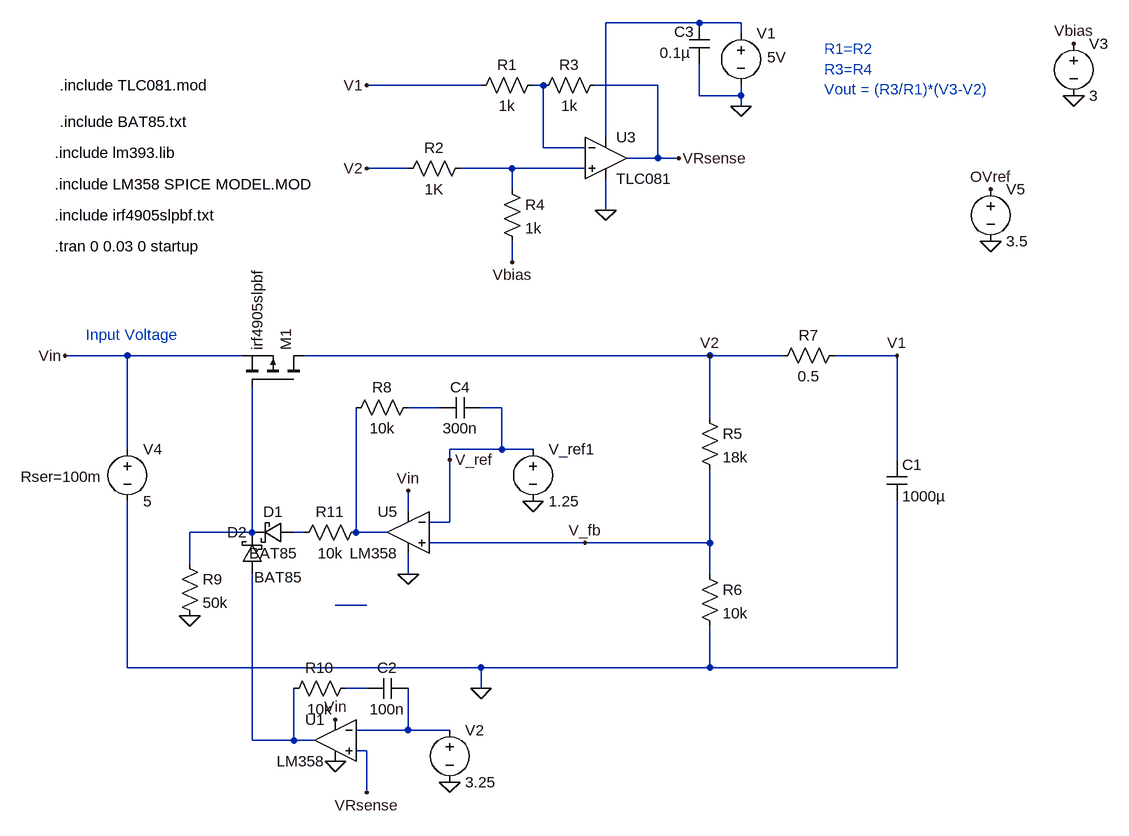
[diagram p0: schematic Differential_Amplifier.asc]
Differential_Amplifier.asc, the LTspice schematic file:
Version 4
SHEET 1 1252 1408
WIRE 320 48 176 48
WIRE 384 48 320 48
WIRE 384 64 384 48
WIRE -16 144 -192 144
WIRE 80 144 64 144
WIRE 256 144 160 144
WIRE 320 160 320 112
WIRE 384 160 384 144
WIRE 384 160 320 160
WIRE 384 176 384 160
WIRE 176 224 176 48
WIRE 80 240 80 144
WIRE 144 240 80 240
WIRE 256 256 256 144
WIRE 256 256 208 256
WIRE 288 256 256 256
WIRE -128 272 -192 272
WIRE 32 272 -48 272
WIRE 144 272 32 272
WIRE 32 304 32 272
WIRE 176 336 176 288
WIRE 32 416 32 384
WIRE -560 560 -656 560
WIRE -384 560 -560 560
WIRE 336 560 -288 560
WIRE 448 560 336 560
WIRE 624 560 528 560
WIRE -80 640 -128 640
WIRE 16 640 -16 640
WIRE 336 656 336 560
WIRE -560 704 -560 560
WIRE 16 704 16 640
WIRE 16 704 -64 704
WIRE 64 704 16 704
WIRE -368 832 -368 608
WIRE -64 720 -64 704
WIRE 624 720 624 560
WIRE -128 800 -128 768
WIRE -64 816 -64 720
WIRE -64 816 -96 816
WIRE -368 832 -464 832
WIRE -288 832 -304 832
WIRE -208 832 -208 640
WIRE -160 832 -208 832
WIRE 144 848 -96 848
WIRE 336 848 336 736
WIRE 336 848 144 848
WIRE -464 880 -464 832
WIRE -128 896 -128 864
WIRE 336 896 336 848
WIRE -192 944 -240 944
WIRE -560 1040 -560 784
WIRE -16 1040 -560 1040
WIRE 336 1040 336 976
WIRE 336 1040 -16 1040
WIRE 624 1040 624 784
WIRE 624 1040 336 1040
WIRE -192 1072 -224 1072
WIRE -16 1072 -16 1040
WIRE -128 1136 -128 1072
WIRE -128 1136 -208 1136
WIRE -64 1136 -128 1136
WIRE -368 1152 -368 896
WIRE -304 1152 -304 1072
WIRE -304 1152 -368 1152
WIRE -272 1152 -304 1152
WIRE -192 1168 -208 1168
WIRE -192 1232 -192 1168
FLAG 384 176 0
FLAG 176 336 0
FLAG 64 784 0
FLAG -128 896 0
FLAG -16 1072 0
FLAG -656 560 Vin
FLAG -128 768 Vin
FLAG 144 848 V_fb
FLAG -64 720 V_ref
FLAG -192 272 V2
FLAG -192 144 V1
FLAG 288 256 VRsense
FLAG -464 960 0
FLAG -240 1120 Vin
FLAG -240 1184 0
FLAG -64 1216 0
FLAG -192 1232 VRsense
FLAG 336 560 V2
FLAG 624 560 V1
FLAG 896 160 0
FLAG 896 80 Vbias
FLAG 768 304 OVref
FLAG 768 384 0
FLAG 32 416 Vbias
SYMBOL voltage 384 48 R0
WINDOW 3 40 53 Left 2
WINDOW 123 0 0 Left 2
WINDOW 39 0 0 Left 2
SYMATTR Value 5V
SYMATTR InstName V1
SYMBOL res 80 128 R90
WINDOW 0 0 56 VBottom 2
WINDOW 3 32 56 VTop 2
SYMATTR InstName R1
SYMATTR Value 1k
SYMBOL cap 304 48 R0
WINDOW 0 -23 14 Left 2
WINDOW 3 -45 46 Left 2
SYMATTR InstName C3
SYMATTR Value 0.1µ
SYMBOL res 176 128 R90
WINDOW 0 0 56 VBottom 2
WINDOW 3 32 56 VTop 2
SYMATTR InstName R3
SYMATTR Value 1k
SYMBOL res -32 256 R90
WINDOW 0 0 56 VBottom 2
WINDOW 3 32 56 VTop 2
SYMATTR InstName R2
SYMATTR Value 1K
SYMBOL res 16 288 R0
SYMATTR InstName R4
SYMATTR Value 1k
SYMBOL voltage -560 688 R0
WINDOW 123 0 0 Left 0
WINDOW 39 -164 58 Left 2
SYMATTR SpiceLine Rser=100m
SYMATTR InstName V4
SYMATTR Value 5
SYMBOL res 320 640 R0
SYMATTR InstName R5
SYMATTR Value 18k
SYMBOL res 320 880 R0
SYMATTR InstName R6
SYMATTR Value 10k
SYMBOL voltage 64 688 R0
WINDOW 123 0 0 Left 0
WINDOW 39 0 0 Left 0
SYMATTR InstName V_ref1
SYMATTR Value 1.25
SYMBOL cap 608 720 R0
SYMATTR InstName C1
SYMATTR Value 1000µ
SYMATTR SpiceLine Rser=200m
SYMBOL Res 544 544 R90
WINDOW 0 0 56 VBottom 2
WINDOW 3 32 56 VTop 2
SYMATTR InstName R7
SYMATTR Value 0.5
SYMBOL Res -480 864 R0
SYMATTR InstName R9
SYMATTR Value 50k
SYMBOL voltage -64 1120 R0
SYMATTR InstName V2
SYMATTR Value 3.25
SYMBOL Res -208 1056 R90
WINDOW 0 0 56 VBottom 2
WINDOW 3 32 56 VTop 2
SYMATTR InstName R10
SYMATTR Value 10k
SYMBOL Cap -128 1056 R90
WINDOW 0 0 32 VBottom 2
WINDOW 3 32 32 VTop 2
SYMATTR InstName C2
SYMATTR Value 100n
SYMBOL pmos -288 608 M270
WINDOW 0 56 28 Left 2
WINDOW -1 56 50 Left 2
SYMATTR InstName M1
SYMATTR Value irf4905slpbf
SYMATTR Prefix X
SYMBOL OpAmps/opamp2 -128 768 M0
SYMATTR InstName U5
SYMATTR Value LM358
SYMBOL OpAmps/opamp2 -240 1088 M0
SYMATTR InstName U1
SYMATTR Value LM358
SYMBOL schottky -304 816 R90
WINDOW 0 0 32 VBottom 2
WINDOW 3 32 32 VTop 2
SYMATTR InstName D1
SYMATTR Value BAT85
SYMATTR Prefix X
SYMATTR Description Diode
SYMATTR Type diode
SYMBOL schottky -352 896 R180
WINDOW 0 24 64 Left 2
WINDOW 3 -61 -5 Left 2
SYMATTR InstName D2
SYMATTR Value BAT85
SYMATTR Prefix X
SYMATTR Description Diode
SYMATTR Type diode
SYMBOL OpAmps/opamp2 176 192 R0
SYMATTR InstName U3
SYMATTR Value TLC081
SYMBOL voltage 896 64 R0
SYMATTR InstName V3
SYMATTR Value 3
SYMBOL Voltage 768 288 R0
SYMATTR InstName V5
SYMATTR Value 3.5
SYMBOL Res -112 624 R90
WINDOW 0 0 56 VBottom 2
WINDOW 3 32 56 VTop 2
SYMATTR InstName R8
SYMATTR Value 10k
SYMBOL Cap -16 624 R90
WINDOW 0 0 32 VBottom 2
WINDOW 3 32 32 VTop 2
SYMATTR InstName C4
SYMATTR Value 300n
SYMBOL Res -192 816 R90
WINDOW 0 0 56 VBottom 2
WINDOW 3 32 56 VTop 2
SYMATTR InstName R11
SYMATTR Value 10k
TEXT 512 88 Left 2 ;R1=R2\nR3=R4\nVout = (R3/R1)*(V3-V2)
TEXT -624 528 Left 2 ;Input Voltage
TEXT -672 392 Left 2 !.tran 0 0.03 0 startup
TEXT -672 344 Left 2 !.include irf4905slpbf.txt
TEXT -672 296 Left 2 !.include LM358 SPICE MODEL.MOD
TEXT -672 248 Left 2 !.include lm393.lib
TEXT -664 200 Left 2 !.include BAT85.txt
TEXT -664 144 Left 2 !.include TLC081.mod

The netlist it stands for:
* Differential_Amplifier.asc
V1 N001 0 5V
R1 N002 V1 1k
C3 N001 0 0.1µ
R3 VRsense N002 1k
R2 N003 V2 1K
R4 N003 Vbias 1k
V4 Vin 0 5 Rser=100m
R5 V2 V_fb 18k
R6 V_fb 0 10k
V_ref1 V_ref 0 1.25
C1 V1 0 1000µ Rser=200m
R7 V1 V2 0.5
R9 N005 0 50k
V2 N010 0 3.25
R10 N009 N011 10k
C2 N010 N009 100n
XM1 V2 N005 Vin irf4905slpbf  ; pins D G S
XU5 V_fb V_ref Vin 0 N007 LM358  ; pins In+ In- V+ V- OUT
XU1 VRsense N010 Vin 0 N011 LM358  ; pins In+ In- V+ V- OUT
XD1 N006 N005 BAT85  ; pins + -
XD2 N011 N005 BAT85  ; pins + -
XU3 N003 N002 N001 0 VRsense TLC081  ; pins In+ In- V+ V- OUT
V3 Vbias 0 3
V5 OVref 0 3.5
R8 N004 N007 10k
C4 V_ref N004 300n
R11 N007 N006 10k
* R1=R2
* R3=R4
* Vout = (R3/R1)*(V3-V2)
* Input Voltage
.tran 0 0.03 0 startup
.include irf4905slpbf.txt
.include LM358 SPICE MODEL.MOD
.include lm393.lib
.include BAT85.txt
.include TLC081.mod
.backanno
.end

* Results of the author's LTspice run, read from the files saved beside the schematic
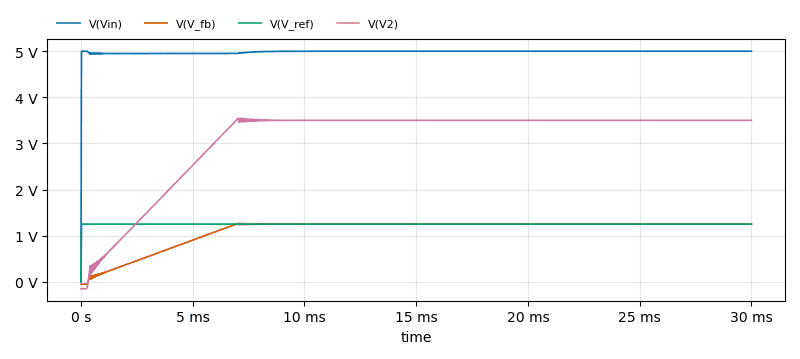
[diagram p1: Transient Analysis of Differential_Amplifier.asc, plotted from the saved traces]
* Transient Analysis, 1 run:
*   V(Vin): min -2.289 µV, max 5 V, average 4.986 V, rms 4.987 V, last 5 V
*   V(V_fb): min -55.14 mV, max 1.268 V, average 1.106 V, rms 1.15 V, last 1.25 V
*   V(V_ref): min 0 V, max 1.25 V, average 1.25 V, rms 1.25 V, last 1.25 V
*   V(V2): min -154.4 mV, max 3.551 V, average 3.096 V, rms 3.221 V, last 3.501 V